# Altium schematic sheet Main Board.SchDoc: Main Board
size A4; Date: 2016/01/06; Author: Samuel López; DocumentNumber: 1; SheetNumber: 1; SheetTotal: 7; Project: H2H Main Board
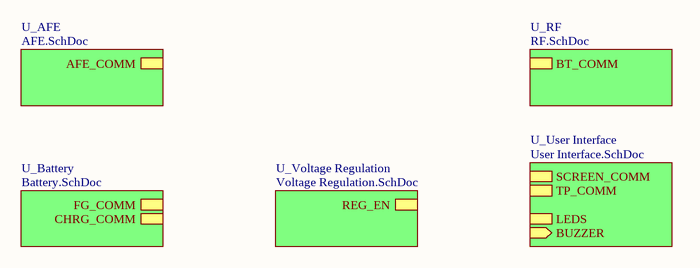
[diagram p0: Main Board.SchDoc]

## Sub-sheets
U_AFE = AFE.SchDoc: AFE_COMM (harness AFE_COMM)
U_Battery = Battery.SchDoc: FG_COMM (harness FG_COMM), CHRG_COMM (harness CHRG_COMM)
U_RF = RF.SchDoc: BT_COMM (harness BT_COMM)
U_User Interface = User Interface.SchDoc: SCREEN_COMM (harness SCREEN_COMM), TP_COMM (harness TP_COMM), LEDS (harness LEDS), BUZZER (in)
U_Voltage Regulation = Voltage Regulation.SchDoc: REG_EN (harness REG_EN)

## Notes on the sheet
- Project:
- Title:
- Sheet
- Author:
- of
- Date:
- Date